# Altium project VFD_project_alpha.PrjPCB
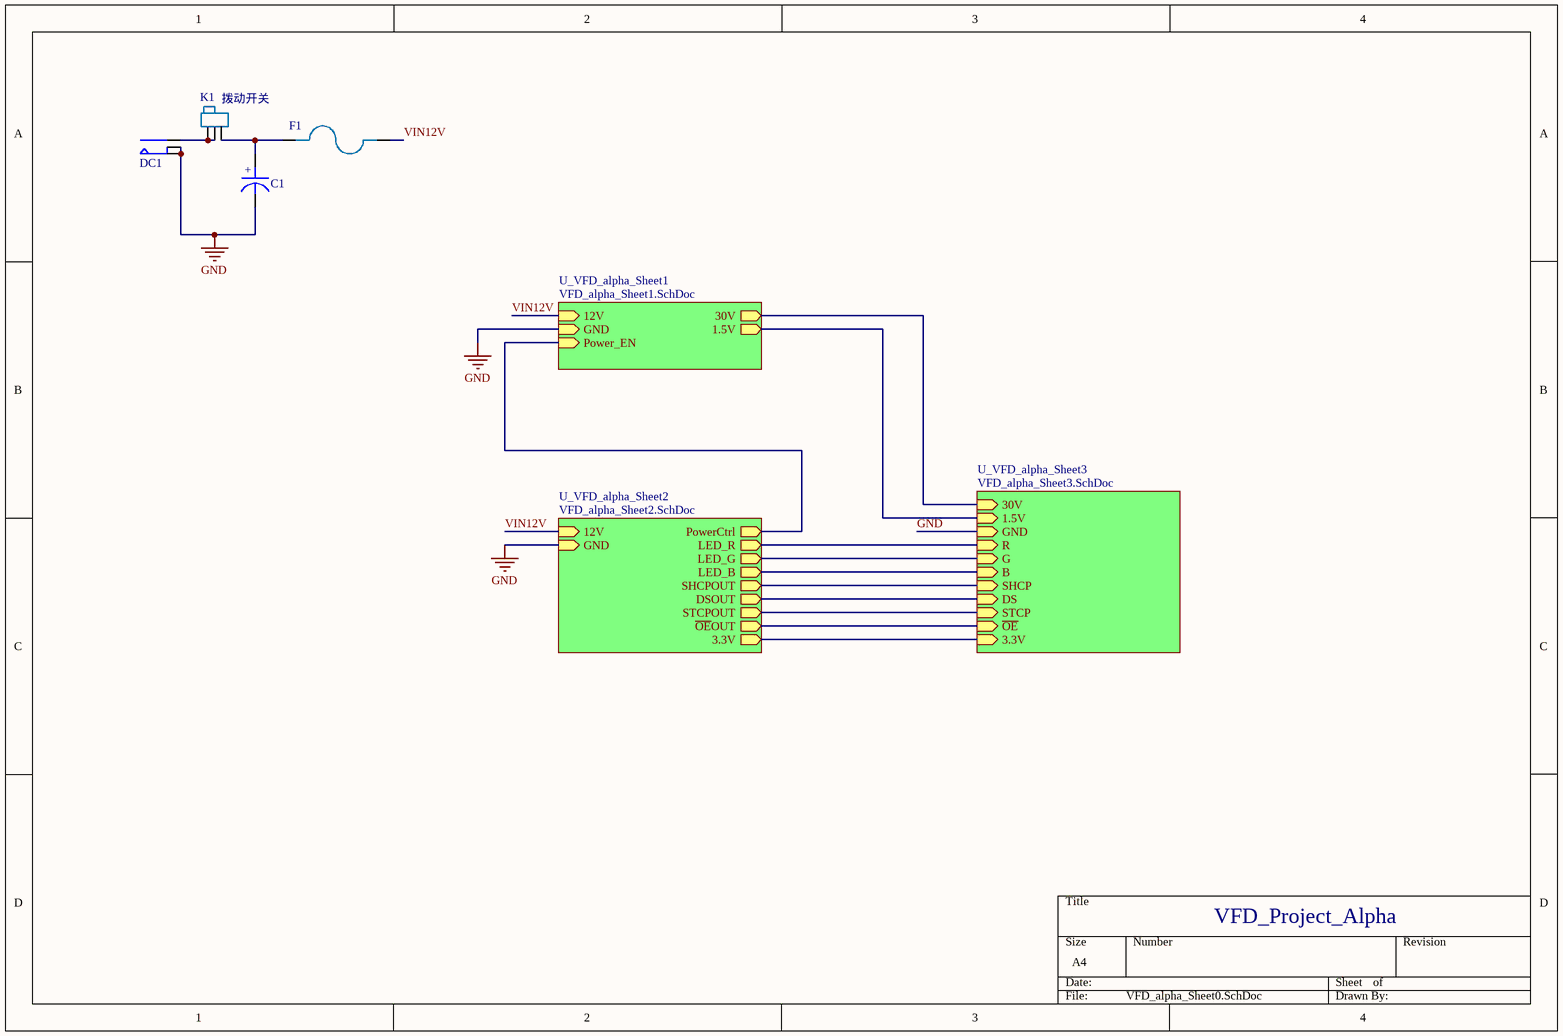
[diagram p0: VFD_alpha_Sheet0.SchDoc]
4 sheets, 130 parts. Net scope: hierarchical (ports join the sheet entries above them; power ports are global).
Board file: VFD_alpha.PcbDoc
Sheets:
  VFD_alpha_Sheet0.SchDoc
    U_VFD_alpha_Sheet1 = VFD_alpha_Sheet1.SchDoc
    U_VFD_alpha_Sheet2 = VFD_alpha_Sheet2.SchDoc
    U_VFD_alpha_Sheet3 = VFD_alpha_Sheet3.SchDoc

## Sheet VFD_alpha_Sheet0.SchDoc
size A4

### Parts
C1  CAP_D5  [CAP_5_2]  (value not drawn)
DC1  DC-5.5  [DC5.5]  (value not drawn)
F1  保险丝  [1812]  (value not drawn)
K1  拨动开关  [拨动开关]

### Sub-sheets
U_VFD_alpha_Sheet1 = VFD_alpha_Sheet1.SchDoc: 12V (in), GND (in), 30V (out), 1.5V (out), Power_EN (in)
U_VFD_alpha_Sheet2 = VFD_alpha_Sheet2.SchDoc: 12V (in), GND (in), PowerCtrl (out), LED_R (out), LED_G (out), LED_B (out), SHCPOUT (out), DSOUT (out), STCPOUT (out), ~{OE}OUT (out), 3.3V (out)
U_VFD_alpha_Sheet3 = VFD_alpha_Sheet3.SchDoc: 30V (in), 1.5V (in), GND (in), R (in), G (in), B (in), SHCP (in), DS (in), STCP (in), ~{OE} (in), 3.3V (in)

### Nets
GND: C1.2 DC1.2 DC1.3 ; sheet U_VFD_alpha_Sheet1/GND, sheet U_VFD_alpha_Sheet2/GND, sheet U_VFD_alpha_Sheet3/GND
VFD3.3V: sheet U_VFD_alpha_Sheet2/3.3V, sheet U_VFD_alpha_Sheet3/3.3V
EN: sheet U_VFD_alpha_Sheet1/Power_EN, sheet U_VFD_alpha_Sheet2/PowerCtrl
VFD1.5V: sheet U_VFD_alpha_Sheet1/1.5V, sheet U_VFD_alpha_Sheet3/1.5V
VFD30V: sheet U_VFD_alpha_Sheet1/30V, sheet U_VFD_alpha_Sheet3/30V
VFDDS: sheet U_VFD_alpha_Sheet2/DSOUT, sheet U_VFD_alpha_Sheet3/DS
VFDOE: sheet U_VFD_alpha_Sheet2/~{OE}OUT, sheet U_VFD_alpha_Sheet3/~{OE}
VFDSHCP: sheet U_VFD_alpha_Sheet2/SHCPOUT, sheet U_VFD_alpha_Sheet3/SHCP
VFDSTCP: sheet U_VFD_alpha_Sheet2/STCPOUT, sheet U_VFD_alpha_Sheet3/STCP
VIN12V: F1.2 ; sheet U_VFD_alpha_Sheet1/12V, sheet U_VFD_alpha_Sheet2/12V  [project net VCC_12V]
NetC1_1: C1.1 F1.1 K1.3
NetDC1_1: DC1.1 K1.1 K1.2
NetR28_2: sheet U_VFD_alpha_Sheet2/LED_G, sheet U_VFD_alpha_Sheet3/G
NetR29_2: sheet U_VFD_alpha_Sheet2/LED_R, sheet U_VFD_alpha_Sheet3/R
NetR30_2: sheet U_VFD_alpha_Sheet2/LED_B, sheet U_VFD_alpha_Sheet3/B

### Notes on the sheet
- VFD_Project_Alpha
- (in symbol CAP_D5) +

## Sheet VFD_alpha_Sheet1.SchDoc
size A4
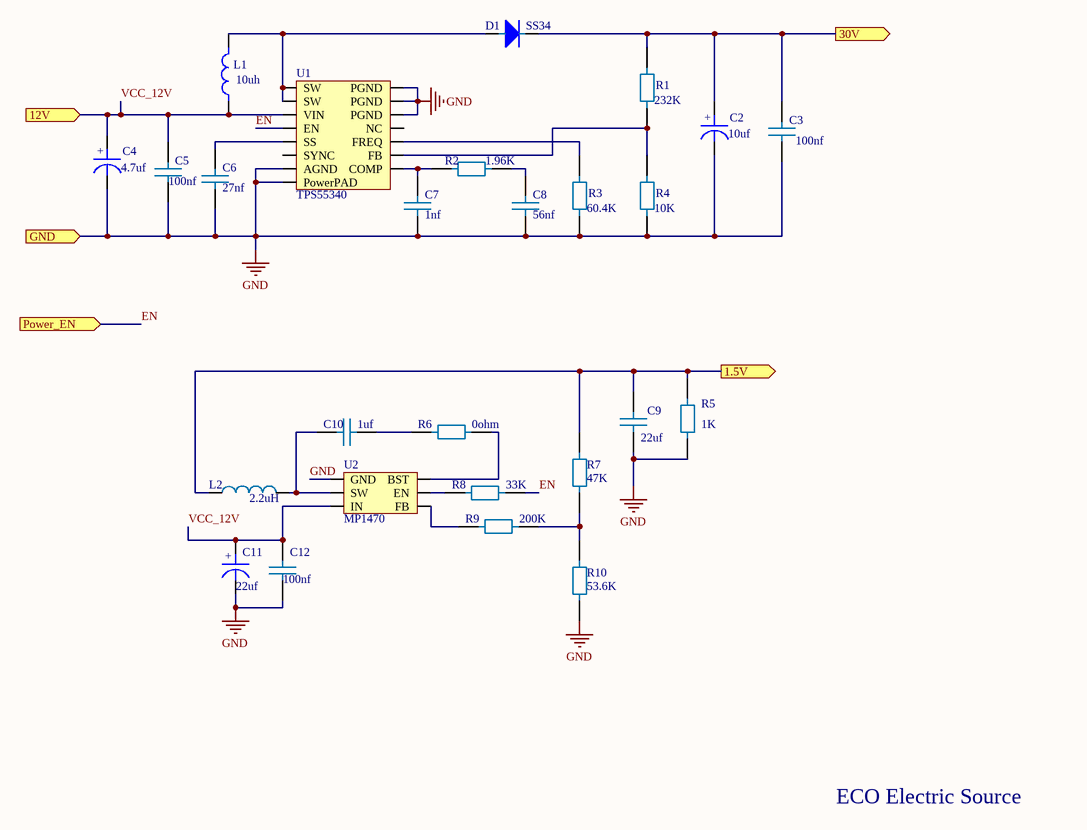
[diagram p1: VFD_alpha_Sheet1.SchDoc]

### Parts
C2  value 10uf  [CAP_5_2]
C3  value 100nf  [0805]  (hidden comment: C(0805))
C4  value 4.7uf  [CAP_5_2]
C5  value 100nf  [0805]  (hidden comment: C(0805))
C6  value 27nf  [0805]  (hidden comment: C(0805))
C7  value 1nf  [0805]  (hidden comment: C(0805))
C8  value 56nf  [0805]  (hidden comment: C(0805))
C9  value 22uf  [1206]  (hidden comment: C(1206))
C10  value 1uf  [0805]  (hidden comment: C(0805))
C11  value 22uf  [CAP_5_2]  (hidden comment: CAP_D5)
C12  value 100nf  [0805]  (hidden comment: C(0805))
D1  SS34  [DO-214AC]
L1  value 10uh  [INDP6.0*6.0*4.7]  (hidden comment: 功率电感(6045))
L2  value 2.2uH  [INDP3.0*3.0*1.5]  (hidden comment: 功率电感(3015))
R1  value 232K  [0805]  (hidden comment: R(0805))
R2  value 1.96K  [0805]  (hidden comment: R(0805))
R3  value 60.4K  [0805]  (hidden comment: R(0805))
R4  value 10K  [0805]  (hidden comment: R(0805))
R5  value 1K  [0805]  (hidden comment: R(0805))
R6  value 0ohm  [0805]  (hidden comment: R(0805))
R7  value 47K  [0805]  (hidden comment: R(0805))
R8  value 33K  [0805]  (hidden comment: R(0805))
R9  value 200K  [0805]  (hidden comment: R(0805))
R10  value 53.6K  [0805]  (hidden comment: R(0805))
U1  TPS55340  [PWP_TPS55340]
U2  MP1470  [SOT95-6N-MT3608]

### Ports
1.5V (out), 12V (in), 30V (out), GND (in), Power_EN (in)

### Nets
GND: C2.2 C3.1 C4.2 C5.1 C6.1 C7.1 C8.2 C9.1 C11.2 C12.1 R3.1 R4.1 R5.1 R10.1 U1.0(PowerPAD) U1.7(AGND) U1.12(PGND) U1.13(PGND) U1.14(PGND) U2.1(GND) ; port GND
EN: R8.2 U1.4(EN) ; port Power_EN
VCC_12V: C4.1 C5.2 C11.1 C12.2 L1.1 U1.3(VIN) U2.3(IN) ; port 12V
VFD1.5V: C9.2 L2.1 R5.2 R7.2 ; port 1.5V
VFD30V: C2.1 C3.2 D1.2 R1.2 ; port 30V
NetC6_2: C6.2 U1.5(SS)
NetC7_2: C7.2 R2.1 U1.8(COMP)
NetC8_1: C8.1 R2.2
NetC10_1: C10.1 L2.2 U2.2(SW)
NetC10_2: C10.2 R6.1
NetD1_1: D1.1 L1.2 U1.1(SW) U1.2(SW)
NetR1_1: R1.1 R4.2 U1.9(FB)
NetR3_2: R3.2 U1.10(FREQ)
NetR6_2: R6.2 U2.6(BST)
NetR7_1: R7.1 R9.2 R10.2
NetR8_1: R8.1 U2.5(EN)
NetR9_1: R9.1 U2.4(FB)

Not connected (* = marked no-connect by the designer): U1 6(SYNC) 11(NC)

### Notes on the sheet
- ECO Electric Source
- (in symbol CAP_D5) +

### Library data of the parts
C2 C4 = CAP_D5

## Sheet VFD_alpha_Sheet2.SchDoc
size A4
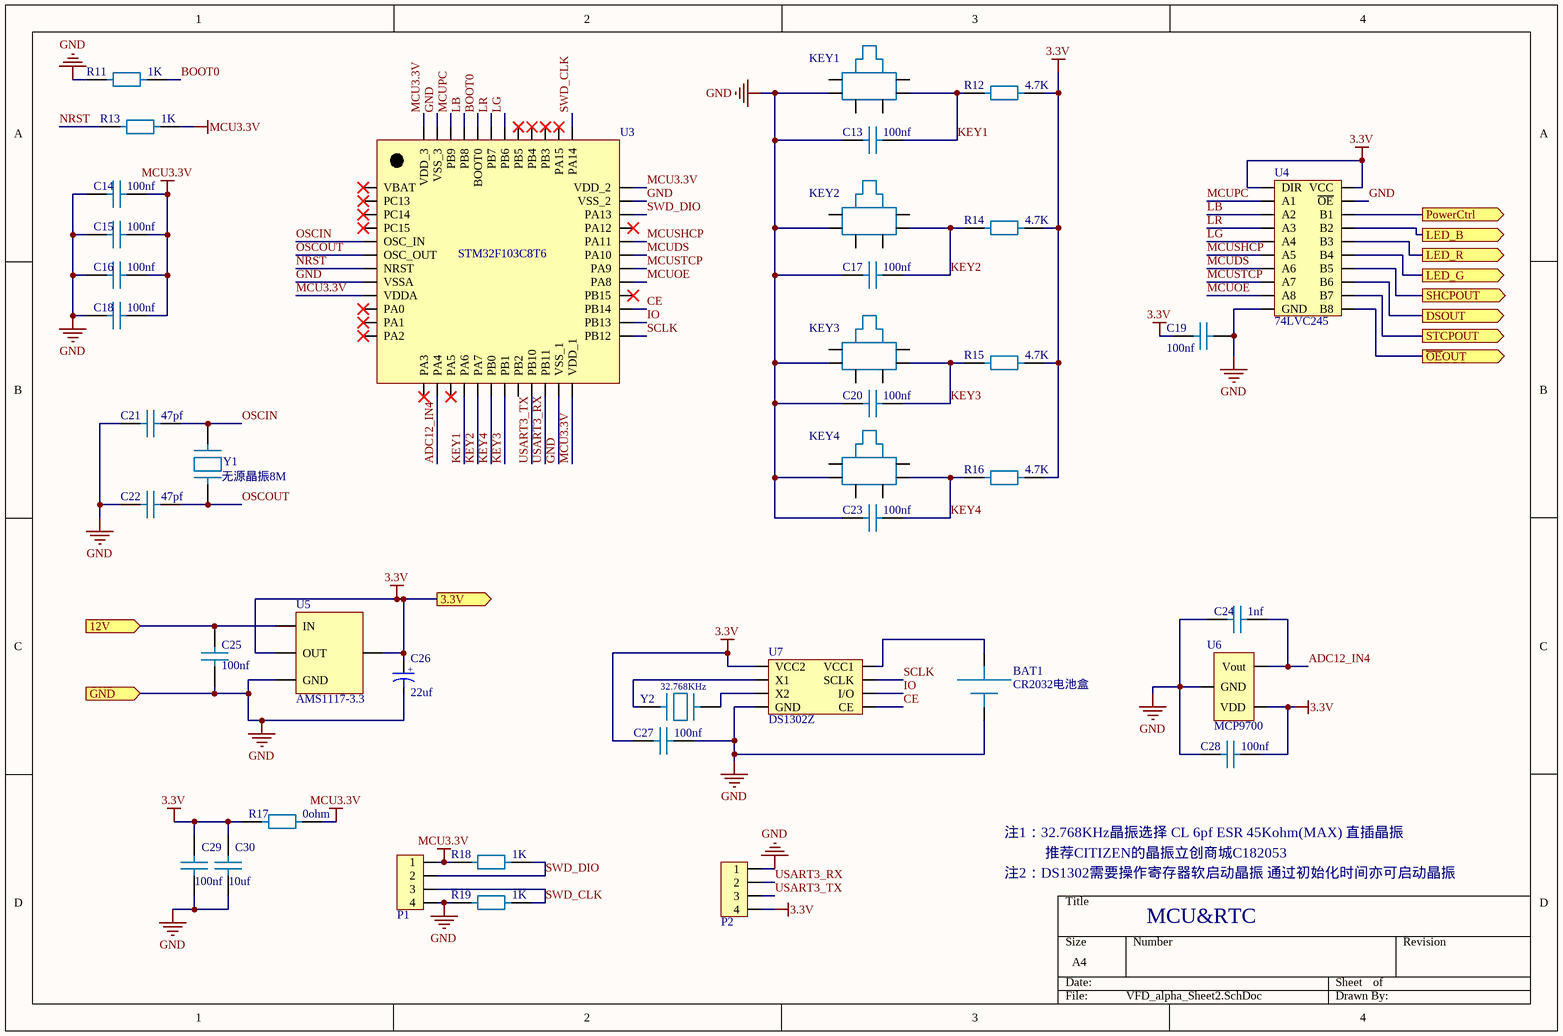
[diagram p2: VFD_alpha_Sheet2.SchDoc]

### Parts
BAT1  CR2032电池盒  [SBAT-CR2032]
C13  value 100nf  [0603]  (hidden comment: C)
C14  value 100nf  [0603]  (hidden comment: C)
C15  value 100nf  [0603]  (hidden comment: C)
C16  value 100nf  [0603]  (hidden comment: C)
C17  value 100nf  [0603]  (hidden comment: C)
C18  value 100nf  [0603]  (hidden comment: C)
C19  value 100nf  [0603]  (hidden comment: C)
C20  value 100nf  [0603]  (hidden comment: C)
C21  value 47pf  [0603]  (hidden comment: C)
C22  value 47pf  [0603]  (hidden comment: C)
C23  value 100nf  [0603]  (hidden comment: C)
C24  value 1nf  [0603]  (hidden comment: C)
C25  value 100nf  [0805]  (hidden comment: C(0805))
C26  value 22uf  [CAPCP3216X06N]  (hidden comment: 钽电容)
C27  value 100nf  [0603]  (hidden comment: C)
C28  value 100nf  [0603]  (hidden comment: C)
C29  value 100nf  [0603]  (hidden comment: C)
C30  value 10uf  [0603]  (hidden comment: C)
KEY1  无锁按键  [侧面按键]  (value not drawn)
KEY2  无锁按键  [侧面按键]  (value not drawn)
KEY3  无锁按键  [侧面按键]  (value not drawn)
KEY4  无锁按键  [侧面按键]  (value not drawn)
P1  连接器4P  [Connector4P]  (value not drawn)
P2  连接器4P  [Connector4P]  (value not drawn)
R11  value 1K  [0603]  (hidden comment: R)
R12  value 4.7K  [0603]  (hidden comment: R)
R13  value 1K  [0603]  (hidden comment: R)
R14  value 4.7K  [0603]  (hidden comment: R)
R15  value 4.7K  [0603]  (hidden comment: R)
R16  value 4.7K  [0603]  (hidden comment: R)
R17  value 0ohm  [0603]  (hidden comment: R)
R18  value 1K  [0603]  (hidden comment: R)
R19  value 1K  [0603]  (hidden comment: R)
U3  STM32F103C8T6  [STM32F103x8LQFP48]
U4  74LVC245  [TSOP-20N-74LVC245]
U5  AMS1117-3.3  [AMS1117-3.3]
U6  MCP9700  [SOT-23-s8550]
U7  DS1302Z  [SOIC-8P DS1302Z]
Y1  无源晶振8M  [晶振8M]
Y2  直插无源晶振32.768KHz  [2*6_OSC]  (value not drawn)

### Ports
3.3V (out), 12V (in), DSOUT (out), GND (in), LED_B (out), LED_G (out), LED_R (out), PowerCtrl (out), SHCPOUT (out), STCPOUT (out), ~{OE}OUT (out)

### Nets
3.3V: C19.1 C26.1 C27.1 C28.2 C29.2 C30.2 P2.4 R12.2 R14.2 R15.2 R16.2 R17.1 U4.1(DIR) U4.20(VCC) U5.2(OUT) U5.4 U6.1(VDD) U7.1(VCC2) ; port 3.3V  [project net VFD3.3V]
GND: BAT1.1 C13.1 C14.1 C15.1 C16.1 C17.1 C18.1 C19.2 C20.1 C21.1 C22.1 C23.1 C24.1 C25.1 C26.2 C27.2 C28.1 C29.1 C30.1 KEY1.2 KEY2.2 KEY3.2 KEY4.2 P1.4 P2.1 R11.2 R19.1 U3.8(VSSA) U3.23(VSS_1) U3.35(VSS_2) U3.47(VSS_3) U4.10(GND) U4.19(~{OE}) U5.1(GND) U6.2(GND) U7.4(GND) ; port GND
MCU3.3V: C14.2 C15.2 C16.2 C18.2 P1.1 R13.2 R17.2 R18.2 U3.9(VDDA) U3.24(VDD_1) U3.36(VDD_2) U3.48(VDD_3)
ADC12_IN4: C24.2 U3.14(PA4) U6.3(Vout)
BOOT0: R11.1 U3.44(BOOT0)
CE: U3.27(PB14) U7.5(CE)
EN: U4.18(B1) ; port PowerCtrl
IO: U3.26(PB13) U7.6(I/O)
KEY1: C13.2 KEY1.5 R12.1 U3.16(PA6)
KEY2: C17.2 KEY2.5 R14.1 U3.17(PA7)
KEY3: C20.2 KEY3.5 R15.1 U3.19(PB1)
KEY4: C23.2 KEY4.5 R16.1 U3.18(PB0)
LB: U3.45(PB8) U4.3(A2)
LG: U3.42(PB6) U4.5(A4)
LR: U3.43(PB7) U4.4(A3)
MCUDS: U3.31(PA10) U4.7(A6)
MCUOE: U3.29(PA8) U4.9(A8)
MCUPC: U3.46(PB9) U4.2(A1)
MCUSHCP: U3.32(PA11) U4.6(A5)
MCUSTCP: U3.30(PA9) U4.8(A7)
NRST: R13.1 U3.7(NRST)
OSCIN: C21.2 U3.5(OSC_IN) Y1.2
OSCOUT: C22.2 U3.6(OSC_OUT) Y1.1
SCLK: U3.25(PB12) U7.7(SCLK)
SWD_CLK: P1.3 R19.2 U3.37(PA14)
SWD_DIO: P1.2 R18.1 U3.34(PA13)
USART3_RX: P2.2 U3.22(PB11)
USART3_TX: P2.3 U3.21(PB10)
VCC_12V: C25.2 U5.3(IN) ; port 12V
VFDDS: U4.13(B6) ; port DSOUT
VFDOE: U4.11(B8) ; port ~{OE}OUT
VFDSHCP: U4.14(B5) ; port SHCPOUT
VFDSTCP: U4.12(B7) ; port STCPOUT
NetBAT1_2: BAT1.2 U7.8(VCC1)
NetR28_2: U4.15(B4) ; port LED_G
NetR29_2: U4.16(B3) ; port LED_R
NetR30_2: U4.17(B2) ; port LED_B
NetU7_2: U7.2(X1) Y2.1
NetU7_3: U7.3(X2) Y2.2

Not connected (* = marked no-connect by the designer): KEY1 1 3 4 6; KEY2 1 3 4 6; KEY3 1 3 4 6; KEY4 1 3 4 6; U3 1(VBAT)* 2(PC13)* 3(PC14)* 4(PC15)* 10(PA0)* 11(PA1)* 12(PA2)* 13(PA3)* 15(PA5)* 20(PB2) 28(PB15)* 33(PA12)* 38(PA15)* 39(PB3)* 40(PB4)* 41(PB5)*

### Notes on the sheet
- 注1：32.768KHz晶振选择 CL 6pf ESR 45Kohm(MAX) 直插晶振
- 注2：DS1302需要操作寄存器软启动晶振 通过初始化时间亦可启动晶振
- 推荐CITIZEN的晶振立创商城C182053
- MCU&RTC
- (in symbol 直插无源晶振32.768KHz) 32.768KHz
- (in symbol 钽电容(3216)) +

### Library data of the parts
C13-C24 C27-C30 = C(0603)
C26 = 钽电容(3216)
R11-R19 = R(0603)
U5 = AMS1117-X
Y1 = 无源晶振8M: value: 无源晶振8M

## Sheet VFD_alpha_Sheet3.SchDoc
size A4
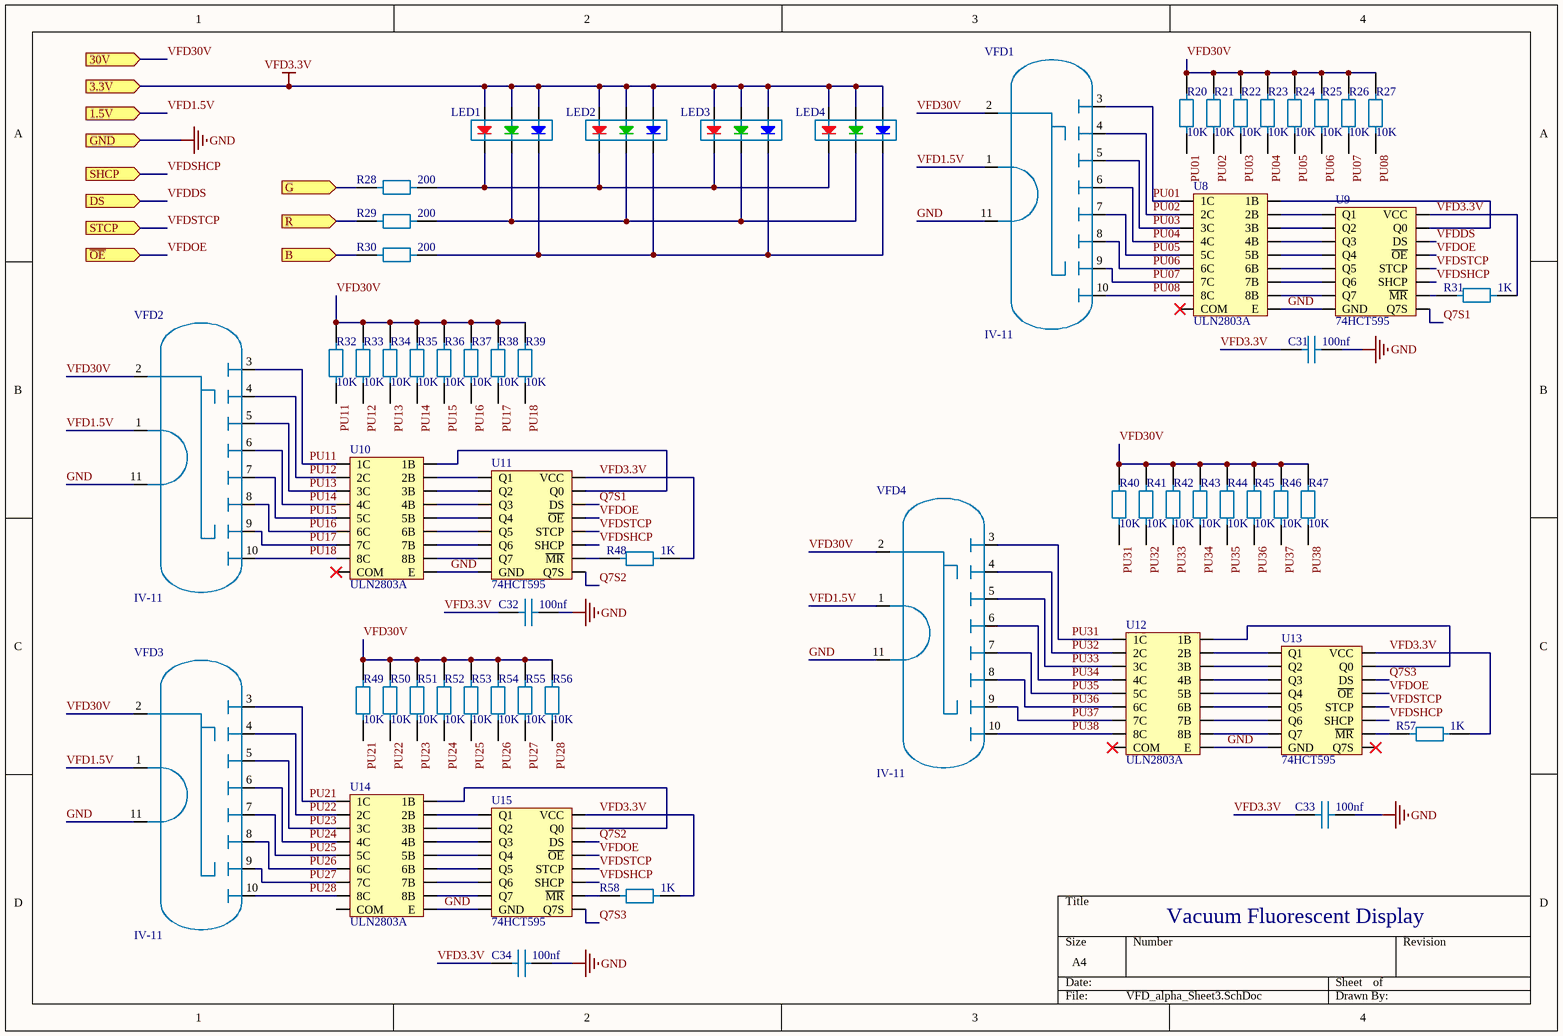
[diagram p3: VFD_alpha_Sheet3.SchDoc]

### Parts
C31  value 100nf  [0603]  (hidden comment: C)
C32  value 100nf  [0603]  (hidden comment: C)
C33  value 100nf  [0603]  (hidden comment: C)
C34  value 100nf  [0603]  (hidden comment: C)
LED1  RGBLED  [RGBLED]  (value not drawn)
LED2  RGBLED  [RGBLED]  (value not drawn)
LED3  RGBLED  [RGBLED]  (value not drawn)
LED4  RGBLED  [RGBLED]  (value not drawn)
R20  value 10K  [R-1/4W]  (hidden comment: R(1/4W))
R21  value 10K  [R-1/4W]  (hidden comment: R(1/4W))
R22  value 10K  [R-1/4W]  (hidden comment: R(1/4W))
R23  value 10K  [R-1/4W]  (hidden comment: R(1/4W))
R24  value 10K  [R-1/4W]  (hidden comment: R(1/4W))
R25  value 10K  [R-1/4W]  (hidden comment: R(1/4W))
R26  value 10K  [R-1/4W]  (hidden comment: R(1/4W))
R27  value 10K  [R-1/4W]  (hidden comment: R(1/4W))
R28  value 200  [0603]  (hidden comment: R)
R29  value 200  [0603]  (hidden comment: R)
R30  value 200  [0603]  (hidden comment: R)
R31  value 1K  [0603]  (hidden comment: R)
R32  value 10K  [R-1/4W]  (hidden comment: R(1/4W))
R33  value 10K  [R-1/4W]  (hidden comment: R(1/4W))
R34  value 10K  [R-1/4W]  (hidden comment: R(1/4W))
R35  value 10K  [R-1/4W]  (hidden comment: R(1/4W))
R36  value 10K  [R-1/4W]  (hidden comment: R(1/4W))
R37  value 10K  [R-1/4W]  (hidden comment: R(1/4W))
R38  value 10K  [R-1/4W]  (hidden comment: R(1/4W))
R39  value 10K  [R-1/4W]  (hidden comment: R(1/4W))
R40  value 10K  [R-1/4W]  (hidden comment: R(1/4W))
R41  value 10K  [R-1/4W]  (hidden comment: R(1/4W))
R42  value 10K  [R-1/4W]  (hidden comment: R(1/4W))
R43  value 10K  [R-1/4W]  (hidden comment: R(1/4W))
R44  value 10K  [R-1/4W]  (hidden comment: R(1/4W))
R45  value 10K  [R-1/4W]  (hidden comment: R(1/4W))
R46  value 10K  [R-1/4W]  (hidden comment: R(1/4W))
R47  value 10K  [R-1/4W]  (hidden comment: R(1/4W))
R48  value 1K  [0603]  (hidden comment: R)
R49  value 10K  [R-1/4W]  (hidden comment: R(1/4W))
R50  value 10K  [R-1/4W]  (hidden comment: R(1/4W))
R51  value 10K  [R-1/4W]  (hidden comment: R(1/4W))
R52  value 10K  [R-1/4W]  (hidden comment: R(1/4W))
R53  value 10K  [R-1/4W]  (hidden comment: R(1/4W))
R54  value 10K  [R-1/4W]  (hidden comment: R(1/4W))
R55  value 10K  [R-1/4W]  (hidden comment: R(1/4W))
R56  value 10K  [R-1/4W]  (hidden comment: R(1/4W))
R57  value 1K  [0603]  (hidden comment: R)
R58  value 1K  [0603]  (hidden comment: R)
U8  ULN2803A  [SOIC-18P]
U9  74HCT595  [SOIC-16P]
U10  ULN2803A  [SOIC-18P]
U11  74HCT595  [SOIC-16P]
U12  ULN2803A  [SOIC-18P]
U13  74HCT595  [SOIC-16P]
U14  ULN2803A  [SOIC-18P]
U15  74HCT595  [SOIC-16P]
VFD1  IV-11  [IV-11]
VFD2  IV-11  [IV-11]
VFD3  IV-11  [IV-11]
VFD4  IV-11  [IV-11]

### Ports
1.5V (in), 3.3V (in), 30V (in), B (in), DS (in), G (in), GND (in), R (in), SHCP (in), STCP (in), ~{OE} (in)

### Nets
GND: C31.1 C32.2 C33.2 C34.2 U8.9(E) U9.8(GND) U10.9(E) U11.8(GND) U12.9(E) U13.8(GND) U14.9(E) U15.8(GND) VFD1.11 VFD2.11 VFD3.11 VFD4.11 ; port GND
VFD3.3V: C31.2 C32.1 C33.1 C34.1 LED1.1 LED1.2 LED1.3 LED2.1 LED2.2 LED2.3 LED3.1 LED3.2 LED3.3 LED4.1 LED4.2 LED4.3 R31.2 R48.2 R57.2 R58.2 U9.16(VCC) U11.16(VCC) U13.16(VCC) U15.16(VCC) ; port 3.3V
PU01: R20.1 U8.18(1C) VFD1.3
PU02: R21.1 U8.17(2C) VFD1.4
PU03: R22.1 U8.16(3C) VFD1.5
PU04: R23.1 U8.15(4C) VFD1.6
PU05: R24.1 U8.14(5C) VFD1.7
PU06: R25.1 U8.13(6C) VFD1.8
PU07: R26.1 U8.12(7C) VFD1.9
PU08: R27.1 U8.11(8C) VFD1.10
PU11: R32.1 U10.18(1C) VFD2.3
PU12: R33.1 U10.17(2C) VFD2.4
PU13: R34.1 U10.16(3C) VFD2.5
PU14: R35.1 U10.15(4C) VFD2.6
PU15: R36.1 U10.14(5C) VFD2.7
PU16: R37.1 U10.13(6C) VFD2.8
PU17: R38.1 U10.12(7C) VFD2.9
PU18: R39.1 U10.11(8C) VFD2.10
PU21: R49.1 U14.18(1C) VFD3.3
PU22: R50.1 U14.17(2C) VFD3.4
PU23: R51.1 U14.16(3C) VFD3.5
PU24: R52.1 U14.15(4C) VFD3.6
PU25: R53.1 U14.14(5C) VFD3.7
PU26: R54.1 U14.13(6C) VFD3.8
PU27: R55.1 U14.12(7C) VFD3.9
PU28: R56.1 U14.11(8C) VFD3.10
PU31: R40.1 U12.18(1C) VFD4.3
PU32: R41.1 U12.17(2C) VFD4.4
PU33: R42.1 U12.16(3C) VFD4.5
PU34: R43.1 U12.15(4C) VFD4.6
PU35: R44.1 U12.14(5C) VFD4.7
PU36: R45.1 U12.13(6C) VFD4.8
PU37: R46.1 U12.12(7C) VFD4.9
PU38: R47.1 U12.11(8C) VFD4.10
Q7S1: U9.9(Q7S) U11.14(DS)
Q7S2: U11.9(Q7S) U15.14(DS)
Q7S3: U13.14(DS) U15.9(Q7S)
VFD1.5V: VFD1.1 VFD2.1 VFD3.1 VFD4.1 ; port 1.5V
VFD30V: R20.2 R21.2 R22.2 R23.2 R24.2 R25.2 R26.2 R27.2 R32.2 R33.2 R34.2 R35.2 R36.2 R37.2 R38.2 R39.2 R40.2 R41.2 R42.2 R43.2 R44.2 R45.2 R46.2 R47.2 R49.2 R50.2 R51.2 R52.2 R53.2 R54.2 R55.2 R56.2 VFD1.2 VFD2.2 VFD3.2 VFD4.2 ; port 30V
VFDDS: U9.14(DS) ; port DS
VFDOE: U9.13(~{OE}) U11.13(~{OE}) U13.13(~{OE}) U15.13(~{OE}) ; port ~{OE}
VFDSHCP: U9.11(SHCP) U11.11(SHCP) U13.11(SHCP) U15.11(SHCP) ; port SHCP
VFDSTCP: U9.12(STCP) U11.12(STCP) U13.12(STCP) U15.12(STCP) ; port STCP
NetLED1_4: LED1.4 LED2.4 LED3.4 LED4.4 R30.1
NetLED1_5: LED1.5 LED2.5 LED3.5 LED4.5 R29.1
NetLED1_6: LED1.6 LED2.6 LED3.6 LED4.6 R28.1
NetR28_2: R28.2 ; port G
NetR29_2: R29.2 ; port R
NetR30_2: R30.2 ; port B
NetR31_1: R31.1 U9.10(~{MR})
NetR48_1: R48.1 U11.10(~{MR})
NetR57_1: R57.1 U13.10(~{MR})
NetR58_1: R58.1 U15.10(~{MR})
NetU8_1: U8.1(1B) U9.15(Q0)
NetU8_2: U8.2(2B) U9.1(Q1)
NetU8_3: U8.3(3B) U9.2(Q2)
NetU8_4: U8.4(4B) U9.3(Q3)
NetU8_5: U8.5(5B) U9.4(Q4)
NetU8_6: U8.6(6B) U9.5(Q5)
NetU8_7: U8.7(7B) U9.6(Q6)
NetU8_8: U8.8(8B) U9.7(Q7)
NetU10_1: U10.1(1B) U11.15(Q0)
NetU10_2: U10.2(2B) U11.1(Q1)
NetU10_3: U10.3(3B) U11.2(Q2)
NetU10_4: U10.4(4B) U11.3(Q3)
NetU10_5: U10.5(5B) U11.4(Q4)
NetU10_6: U10.6(6B) U11.5(Q5)
NetU10_7: U10.7(7B) U11.6(Q6)
NetU10_8: U10.8(8B) U11.7(Q7)
NetU12_1: U12.1(1B) U13.15(Q0)
NetU12_2: U12.2(2B) U13.1(Q1)
NetU12_3: U12.3(3B) U13.2(Q2)
NetU12_4: U12.4(4B) U13.3(Q3)
NetU12_5: U12.5(5B) U13.4(Q4)
NetU12_6: U12.6(6B) U13.5(Q5)
NetU12_7: U12.7(7B) U13.6(Q6)
NetU12_8: U12.8(8B) U13.7(Q7)
NetU14_1: U14.1(1B) U15.15(Q0)
NetU14_2: U14.2(2B) U15.1(Q1)
NetU14_3: U14.3(3B) U15.2(Q2)
NetU14_4: U14.4(4B) U15.3(Q3)
NetU14_5: U14.5(5B) U15.4(Q4)
NetU14_6: U14.6(6B) U15.5(Q5)
NetU14_7: U14.7(7B) U15.6(Q6)
NetU14_8: U14.8(8B) U15.7(Q7)

Not connected (* = marked no-connect by the designer): U8 10(COM)*; U10 10(COM)*; U12 10(COM)*; U13 9(Q7S)*; U14 10(COM)

### Notes on the sheet
- Vacuum Fluorescent Display

### Library data of the parts
C31-C34 = C(0603)
R28-R31 R48 R57 R58 = R(0603)

## Nets that join several sheets
GND: VFD_alpha_Sheet0 (C1.2 DC1.2 DC1.3), VFD_alpha_Sheet1 (20 pins), VFD_alpha_Sheet2 (36 pins), VFD_alpha_Sheet3 (16 pins)
VFD3.3V: VFD_alpha_Sheet2 (18 pins), VFD_alpha_Sheet3 (24 pins)
EN: VFD_alpha_Sheet1 (R8.2 U1.4), VFD_alpha_Sheet2 (U4.18)
NetR28_2: VFD_alpha_Sheet2 (U4.15), VFD_alpha_Sheet3 (R28.2)
NetR29_2: VFD_alpha_Sheet2 (U4.16), VFD_alpha_Sheet3 (R29.2)
NetR30_2: VFD_alpha_Sheet2 (U4.17), VFD_alpha_Sheet3 (R30.2)
VCC_12V: VFD_alpha_Sheet0 (F1.2), VFD_alpha_Sheet1 (7 pins), VFD_alpha_Sheet2 (C25.2 U5.3)
VFD1.5V: VFD_alpha_Sheet1 (C9.2 L2.1 R5.2 R7.2), VFD_alpha_Sheet3 (VFD1.1 VFD2.1 VFD3.1 VFD4.1)
VFD30V: VFD_alpha_Sheet1 (C2.1 C3.2 D1.2 R1.2), VFD_alpha_Sheet3 (36 pins)
VFDDS: VFD_alpha_Sheet2 (U4.13), VFD_alpha_Sheet3 (U9.14)
VFDOE: VFD_alpha_Sheet2 (U4.11), VFD_alpha_Sheet3 (U9.13 U11.13 U13.13 U15.13)
VFDSHCP: VFD_alpha_Sheet2 (U4.14), VFD_alpha_Sheet3 (U9.11 U11.11 U13.11 U15.11)
VFDSTCP: VFD_alpha_Sheet2 (U4.12), VFD_alpha_Sheet3 (U9.12 U11.12 U13.12 U15.12)